# Altium schematic sheet Sheet2.SchDoc
size A; SheetNumber: 1; SheetTotal: 1
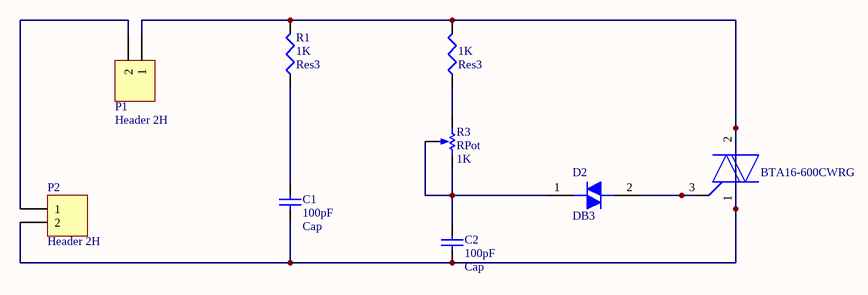
[diagram p0: Sheet2.SchDoc]

## Parts
C1  Cap  value 100pF  [RAD-0.3]
C2  Cap  value 100pF  [RAD-0.3]
D2  DB3  [FAIR-DO-35-2]
P1  Header 2H  [HDR1X2H]
P2  Header 2H  [HDR1X2H]
R1  Res3  value 1K  [J1-0603]
R3  RPot  value 1K  [VR5]
  Res3  value 1K  [J1-0603]
  BTA16-600CWRG  [FP-TO-220AB_Ins-MFG]

## Nets
NetC1_1: C1.1 C2.1 P1.1 P2.2 R1.2 .1(A1) .2
NetC1_2: C1.2 R1.1
NetC2_2: C2.2 D2.1(CATHODE) R3.2(BOT) R3.3(TAP)
NetD2_2: D2.2(ANODE) .3(G)
NetP1_2: P1.2 P2.1
NetR3_1: R3.1(TOP) .1

## Library data of the parts
C1 C2 = Cap: Capacitor; Published: 8-Jun-2000; LatestRevisionDate: 17-Jul-2002; LatestRevisionNote: Re-released for DXP Platform.; PackageReference: RAD-0.3; Publisher: Altium Limited; PackageDescription: Radial Cap, Thru-Hole; 2 Leads; 0.3 in Pin Spacing
D2 = CMP-2000-06141-1: Bi-Directional Trigger Diode, 150 mW, -40 to 125 degC, 2-Pin THD, RoHS, Tape and Reel; Brand: FairchildSemiconductor; Unit Weight: 0.004445oz; On-State RMS Current - It RMS: 2A; Off-State Capacitance CO: 22nF; Breakover Current IBO Max: 0.1mA; Off-State Leakage Current @ VDRM IDRM: 0.01mA; Breakover Voltage VBO: 32V; Manufacturer URL: https://www.fairchildsemi.com/; Package Description: 2-Pin Through Hole Diode, Dia 1.72 mm, Body Length 3.805 mm; Package Reference: DO-35-2; Mounting Style: ThroughHole; Series: DB3; Package / Case: DO-35; RoHS: Details; Datasheet Version: Rev. A1, 09/2010; Packaging: Reel; Package URL: https://www.fairchildsemi.com/package-drawings/DO/DO35A.pdf; Minimum Operating Temperature: -40C; Maximum Operating Temperature: +125C; Factory Pack Quantity: 5000; Product Category: Triacs; Manufacturer: FairchildSemiconductor; Datasheet URL: https://datasheet.ciiva.com/4748/db3-221685-4748448.pdf; On-State RMS Current (It RMS): 2A; Mounting Technology: ThroughHole
P1 P2 = Header 2H: Header, 2-Pin, Right Angle; LatestRevisionDate: 17-Jul-2002; LatestRevisionNote: Re-released for DXP Platform.; Publisher: Altium Limited
R1  = Res3: Resistor; Published: 8-Jun-2000; LatestRevisionDate: 29-May-2009; LatestRevisionNote: IPC-7351 Footprint Added.; PackageReference: J1-0603; Publisher: Altium Limited; PackageDescription: Chip Resistor
R3 = RPot: Potentiometer; Sim Note: Enter the Resistance value and the set point into parameter fields.; Set Position: 0.5; Published: 8-Jun-2000; LatestRevisionDate: 17-Jul-2002; LatestRevisionNote: Re-released for DXP Platform.; PackageReference: VR5; Publisher: Altium Limited; PackageDescription: Variable Resistor, Thru-Hole; 3 Leads
 = CMP-12193-000001-1: TRIAC ALTERNISTOR 600V TO220AB; Manufacturer: STMicroelectronics; On State Current Rms: 16A; Gate Trigger Voltage: 1.3V; Gate Trigger Current: 35mA; Forward Voltage: 1.55V; Max Junction Temp: +125°C; Standoff Height: 3.75mm; Height: 19.65mm; Temperature Range Low: -40°C; Category: Diode; Device Class L2: Thyristors; ComponentLink2URL: https://www.st.com/resource/en/datasheet/bta16.pdf; Ipc Land Pattern Name: TO-220; Temperature: -40°C to +125°C; Temperature Range High: +125°C; Lead Free: Yes; Octopart: https://octopart.com/bta16-600cwrg-stmicroelectronics-360233; Device Class L3: TRIACs; Device Class L1: Discrete Semiconductors; Package: TO-220AB Ins; Manufacturer Part Number: BTA16-600CWRG; Digikey Description: TRIAC ALTERNISTOR 600V TO220AB; Off State Voltage: 600V; ComponentLink2Description: Datasheet; Hold Current: 35mA; Mouser Description: Triacs 16 Amp 600 Volt; RoHS: TRUE; Automotive: No